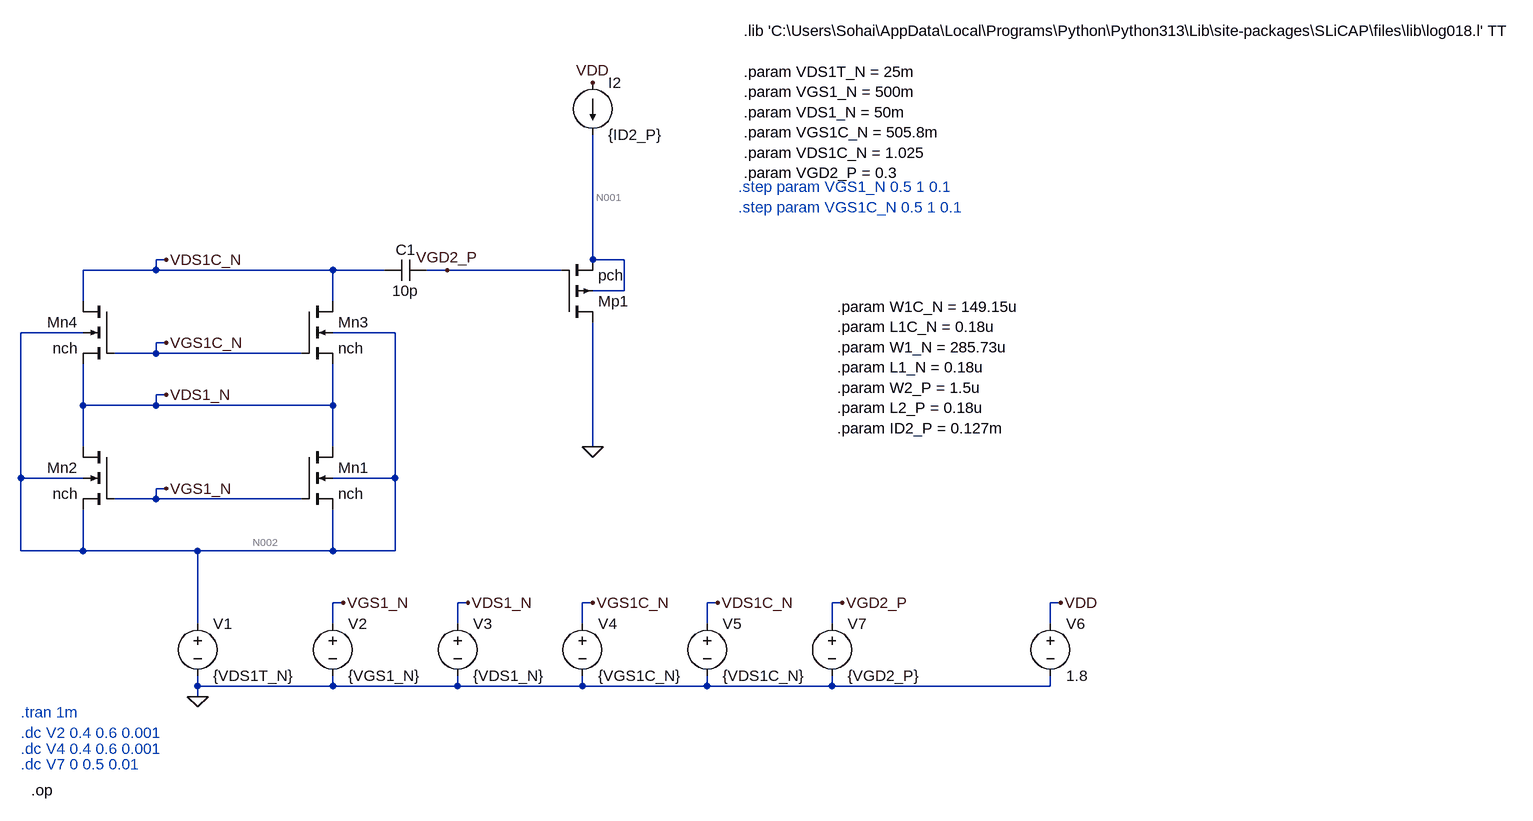
[diagram p0: schematic 2_normalSF.asc]
2_normalSF.asc, the LTspice schematic file:
Version 4
SHEET 1 2348 736
WIRE 112 -128 96 -128
WIRE 768 -128 768 -320
WIRE 816 -128 768 -128
WIRE 96 -112 96 -128
WIRE 96 -112 -16 -112
WIRE 368 -112 96 -112
WIRE 448 -112 368 -112
WIRE 544 -112 512 -112
WIRE 720 -112 544 -112
WIRE 816 -80 816 -128
WIRE 816 -80 768 -80
WIRE -16 -64 -16 -112
WIRE 368 -64 368 -112
WIRE -16 -16 -112 -16
WIRE 464 -16 368 -16
WIRE 112 0 96 0
WIRE 96 16 96 0
WIRE 96 16 32 16
WIRE 320 16 96 16
WIRE 112 80 96 80
WIRE -16 96 -16 32
WIRE 96 96 96 80
WIRE 96 96 -16 96
WIRE 368 96 368 32
WIRE 368 96 96 96
WIRE -16 160 -16 96
WIRE 368 160 368 96
WIRE 768 160 768 -32
WIRE -112 208 -112 -16
WIRE -16 208 -112 208
WIRE 464 208 464 -16
WIRE 464 208 368 208
WIRE 112 224 96 224
WIRE 96 240 96 224
WIRE 96 240 32 240
WIRE 320 240 96 240
WIRE -112 320 -112 208
WIRE -16 320 -16 256
WIRE -16 320 -112 320
WIRE 160 320 -16 320
WIRE 368 320 368 256
WIRE 368 320 160 320
WIRE 464 320 464 208
WIRE 464 320 368 320
WIRE 384 400 368 400
WIRE 576 400 560 400
WIRE 768 400 752 400
WIRE 960 400 944 400
WIRE 1152 400 1136 400
WIRE 1488 400 1472 400
WIRE 160 432 160 320
WIRE 368 432 368 400
WIRE 560 432 560 400
WIRE 752 432 752 400
WIRE 944 432 944 400
WIRE 1136 432 1136 400
WIRE 1472 432 1472 400
WIRE 160 528 160 512
WIRE 368 528 368 512
WIRE 368 528 160 528
WIRE 560 528 560 512
WIRE 560 528 368 528
WIRE 752 528 752 512
WIRE 752 528 560 528
WIRE 944 528 944 512
WIRE 944 528 752 528
WIRE 1136 528 1136 512
WIRE 1136 528 944 528
WIRE 1472 528 1472 512
WIRE 1472 528 1136 528
WIRE 160 544 160 528
FLAG 112 224 VGS1_N
FLAG 112 0 VGS1C_N
FLAG 160 544 0
FLAG 112 80 VDS1_N
FLAG 112 -128 VDS1C_N
FLAG 384 400 VGS1_N
FLAG 576 400 VDS1_N
FLAG 768 400 VGS1C_N
FLAG 960 400 VDS1C_N
FLAG 768 -400 VDD
FLAG 1488 400 VDD
FLAG 768 160 0
FLAG 1152 400 VGD2_P
FLAG 544 -112 VGD2_P
DATAFLAG 240 -112 ""
DATAFLAG 240 16 ""
DATAFLAG 256 96 ""
DATAFLAG 240 240 ""
DATAFLAG 768 -208 ""
DATAFLAG 672 -112 ""
SYMBOL nmos4 320 160 R0
SYMATTR InstName Mn1
SYMATTR Value nch
SYMATTR Value2 l={L1_N} w={W1_N/4} m=4
SYMBOL nmos4 32 160 M0
SYMATTR InstName Mn2
SYMATTR Value nch
SYMATTR Value2 l={L1_N} w={W1_N/4} m=4
SYMBOL nmos4 320 -64 R0
SYMATTR InstName Mn3
SYMATTR Value nch
SYMATTR Value2 l={L1C_N} w={W1C_N/4} m=4
SYMBOL nmos4 32 -64 M0
SYMATTR InstName Mn4
SYMATTR Value nch
SYMATTR Value2 l={L1C_N} w={W1C_N/4} m=4
SYMBOL voltage 160 416 R0
WINDOW 123 0 0 Left 0
WINDOW 39 0 0 Left 0
SYMATTR InstName V1
SYMATTR Value {VDS1T_N}
SYMBOL voltage 368 416 R0
WINDOW 123 0 0 Left 0
WINDOW 39 0 0 Left 0
SYMATTR InstName V2
SYMATTR Value {VGS1_N}
SYMBOL voltage 560 416 R0
WINDOW 123 0 0 Left 0
WINDOW 39 0 0 Left 0
SYMATTR InstName V3
SYMATTR Value {VDS1_N}
SYMBOL voltage 752 416 R0
WINDOW 123 0 0 Left 0
WINDOW 39 0 0 Left 0
SYMATTR InstName V4
SYMATTR Value {VGS1C_N}
SYMBOL voltage 944 416 R0
WINDOW 123 0 0 Left 0
WINDOW 39 0 0 Left 0
SYMATTR InstName V5
SYMATTR Value {VDS1C_N}
SYMBOL pmos4 720 -32 M180
SYMATTR InstName Mp1
SYMATTR Value pch
SYMATTR Value2 l={L2_P} w={W2_P}
SYMBOL voltage 1472 416 R0
WINDOW 123 0 0 Left 0
WINDOW 39 0 0 Left 0
SYMATTR InstName V6
SYMATTR Value 1.8
SYMBOL current 768 -400 R0
WINDOW 123 0 0 Left 0
WINDOW 39 0 0 Left 0
SYMATTR InstName I2
SYMATTR Value {ID2_P}
SYMBOL cap 512 -128 R90
WINDOW 0 0 32 VBottom 2
WINDOW 3 32 32 VTop 2
SYMATTR InstName C1
SYMATTR Value 10p
SYMBOL voltage 1136 416 R0
WINDOW 123 0 0 Left 0
WINDOW 39 0 0 Left 0
SYMATTR InstName V7
SYMATTR Value {VGD2_P}
TEXT 1000 -480 Left 2 !.lib 'C:\\Users\\Sohai\\AppData\\Local\\Programs\\Python\\Python313\\Lib\\site-packages\\SLiCAP\\files\\lib\\log018.l' TT\n \n.param VDS1T_N = 25m\n.param VGS1_N = 500m\n.param VDS1_N = 50m\n.param VGS1C_N = 505.8m\n.param VDS1C_N = 1.025\n.param VGD2_P = 0.3
TEXT 1144 -56 Left 2 !.param W1C_N = 149.15u\n.param L1C_N = 0.18u\n.param W1_N = 285.73u\n.param L1_N = 0.18u\n.param W2_P = 1.5u\n.param L2_P = 0.18u\n.param ID2_P = 0.127m
TEXT -112 568 Left 2 ;.tran 1m
TEXT -112 600 Left 2 ;.dc V2 0.4 0.6 0.001
TEXT 992 -240 Left 2 ;.step param VGS1_N 0.5 1 0.1\n.step param VGS1C_N 0.5 1 0.1
TEXT -112 624 Left 2 ;.dc V4 0.4 0.6 0.001
TEXT -96 688 Left 2 !.op
TEXT -112 648 Left 2 ;.dc V7 0 0.5 0.01

The netlist it stands for:
* 2_normalSF.asc
Mn1 VDS1_N VGS1_N N002 N002 nch l={L1_N} w={W1_N/4} m=4
Mn2 VDS1_N VGS1_N N002 N002 nch l={L1_N} w={W1_N/4} m=4
Mn3 VDS1C_N VGS1C_N VDS1_N N002 nch l={L1C_N} w={W1C_N/4} m=4
Mn4 VDS1C_N VGS1C_N VDS1_N N002 nch l={L1C_N} w={W1C_N/4} m=4
V1 N002 0 {VDS1T_N}
V2 VGS1_N 0 {VGS1_N}
V3 VDS1_N 0 {VDS1_N}
V4 VGS1C_N 0 {VGS1C_N}
V5 VDS1C_N 0 {VDS1C_N}
Mp1 0 VGD2_P N001 N001 pch l={L2_P} w={W2_P}
V6 VDD 0 1.8
I2 VDD N001 {ID2_P}
C1 VGD2_P VDS1C_N 10p
V7 VGD2_P 0 {VGD2_P}
.model NMOS NMOS
.model PMOS PMOS
.lib standard.mos
.lib 'C:\Users\Sohai\AppData\Local\Programs\Python\Python313\Lib\site-packages\SLiCAP\files\lib\log018.l' TT
.param VDS1T_N = 25m
.param VGS1_N = 500m
.param VDS1_N = 50m
.param VGS1C_N = 505.8m
.param VDS1C_N = 1.025
.param VGD2_P = 0.3
.param W1C_N = 149.15u
.param L1C_N = 0.18u
.param W1_N = 285.73u
.param L1_N = 0.18u
.param W2_P = 1.5u
.param L2_P = 0.18u
.param ID2_P = 0.127m
* .tran 1m
* .dc V2 0.4 0.6 0.001
* .step param VGS1_N 0.5 1 0.1
* .step param VGS1C_N 0.5 1 0.1
* .dc V4 0.4 0.6 0.001
.op
* .dc V7 0 0.5 0.01
.backanno
.end

* Results of the author's LTspice run, read from the files saved beside the schematic
* Operating Point:
*   V(vds1_n) = 50 mV
*   V(vgs1_n) = 500 mV
*   V(n002) = 25 mV
*   V(vds1c_n) = 1.025 V
*   V(vgs1c_n) = 505.8 mV
*   V(vgd2_p) = 300 mV
*   V(n001) = 1.512 V
*   V(vdd) = 1.8 V
*   Id(Mn1) = 289.3 µA
*   Ig(Mn1) = 0 A
*   Ib(Mn1) = -124.8 fA
*   Is(Mn1) = -289.3 µA
*   Id(Mn2) = 289.3 µA
*   Ig(Mn2) = 0 A
*   Ib(Mn2) = -124.8 fA
*   Is(Mn2) = -289.3 µA
*   Id(Mn3) = 286.4 µA
*   Ig(Mn3) = 0 A
*   Ib(Mn3) = -393.2 pA
*   Is(Mn3) = -286.4 µA
*   Id(Mn4) = 286.4 µA
*   Ig(Mn4) = 0 A
*   Ib(Mn4) = -393.2 pA
*   Is(Mn4) = -286.4 µA
*   Id(Mp1) = -127 µA
*   Ig(Mp1) = 0 A
*   Ib(Mp1) = 1.783 pA
*   Is(Mp1) = 127 µA
*   I(C1) = 0 A
*   I(I2) = 127 µA
*   I(V1) = 578.6 µA
*   I(V2) = 0 A
*   I(V3) = -5.824 µA
*   I(V4) = 0 A
*   I(V5) = -572.8 µA
*   I(V6) = -127 µA
*   I(V7) = 0 A
* From the log:
*   Semiconductor Device Operating Points:
*                           --- BSIM3 MOSFETS ---
*   Name:        mn1         mn2         mn3         mn4         mp1
*   Model:      nch.3       nch.3       nch.3       nch.3       pch.6
*   Id:        2.89e-04    2.89e-04    2.86e-04    2.86e-04   -1.27e-04
*   Vgs:       4.75e-01    4.75e-01    4.56e-01    4.56e-01   -1.21e+00
*   Vds:       2.50e-02    2.50e-02    9.75e-01    9.75e-01   -1.51e+00
*   Vbs:       0.00e+00    0.00e+00   -2.50e-02   -2.50e-02    0.00e+00
*   Vth:       5.12e-01    5.12e-01    5.17e-01    5.17e-01   -4.97e-01
*   Vdsat:     6.39e-02    6.39e-02    5.71e-02    5.71e-02   -4.84e-01
*   Gm:        5.08e-03    5.08e-03    5.86e-03    5.86e-03    2.74e-04
*   Gds:       8.68e-03    8.68e-03    1.13e-04    1.13e-04    1.10e-05
*   Gmb        1.53e-03    1.53e-03    1.67e-03    1.67e-03    9.52e-05
*   Cbd:       0.00e+00    0.00e+00    0.00e+00    0.00e+00    0.00e+00
*   Cbs:       0.00e+00    0.00e+00    0.00e+00    0.00e+00    0.00e+00
*   Cgsov:     1.05e-13    1.05e-13    5.46e-14    5.46e-14    4.82e-16
*   Cgdov:     1.05e-13    1.05e-13    5.46e-14    5.46e-14    4.82e-16
*   Cgbov:     1.27e-16    1.27e-16    1.27e-16    1.27e-16    4.83e-17
*   dQgdVgb:   3.72e-13    3.72e-13    1.81e-13    1.81e-13    2.84e-15
*   dQgdVdb:  -1.13e-13   -1.13e-13   -5.46e-14   -5.46e-14   -4.78e-16
*   dQgdVsb:  -1.65e-13   -1.65e-13   -7.29e-14   -7.29e-14   -2.26e-15
*   dQddVgb:  -1.20e-13   -1.20e-13   -5.46e-14   -5.46e-14   -4.83e-16
*   dQddVdb:   1.26e-13    1.26e-13    5.46e-14    5.46e-14    4.83e-16
*   dQddVsb:  -1.10e-15   -1.10e-15    1.35e-17    1.35e-17    5.95e-19
*   dQbdVgb:  -9.13e-14   -9.13e-14   -5.31e-14   -5.31e-14   -4.29e-16
*   dQbdVdb:  -5.70e-15   -5.70e-15    1.15e-17    1.15e-17    3.22e-19
*   dQbdVsb:  -1.90e-14   -1.90e-14   -5.52e-15   -5.52e-15   -1.58e-16